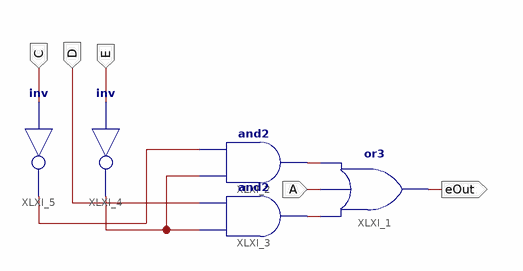
[diagram p0: schematic sheet 1]
// Xilinx ISE schematic e.sch (xa9500xl) as structural Verilog: 5 symbols, 5 ports
module e (
  input  A,
  input  C,
  input  D,
  input  E,
  output eOut
);

  wire XLXN_1, XLXN_2, XLXN_10, XLXN_11;

  or XLXI_1 (eOut, XLXN_2, A, XLXN_1);
  and XLXI_2 (XLXN_1, XLXN_11, XLXN_10);
  and XLXI_3 (XLXN_2, XLXN_11, D);
  not XLXI_4 (XLXN_11, E);
  not XLXI_5 (XLXN_10, C);
endmodule
